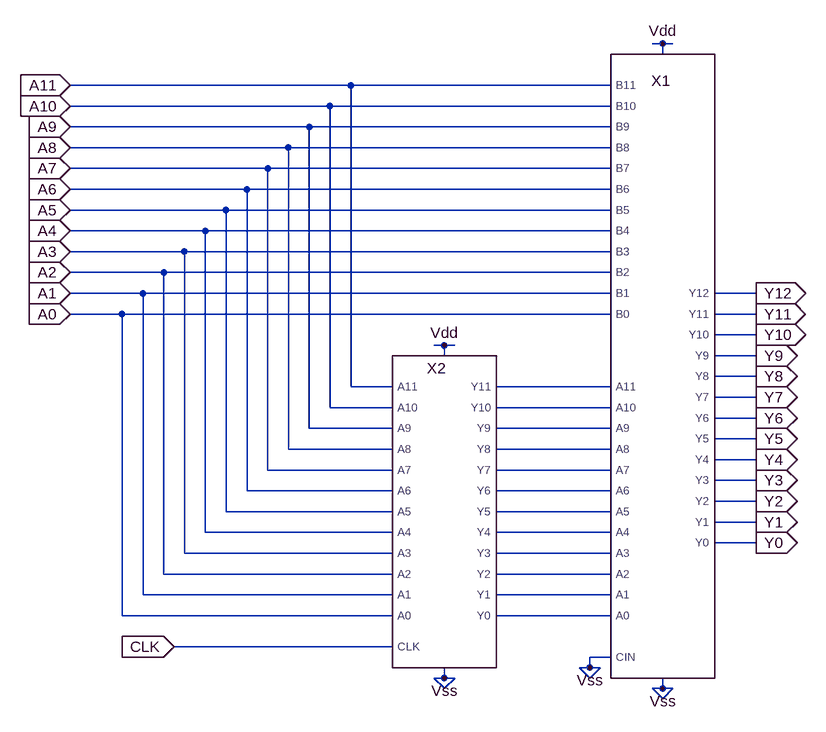
[diagram p0: schematic 12bitavg.asc]
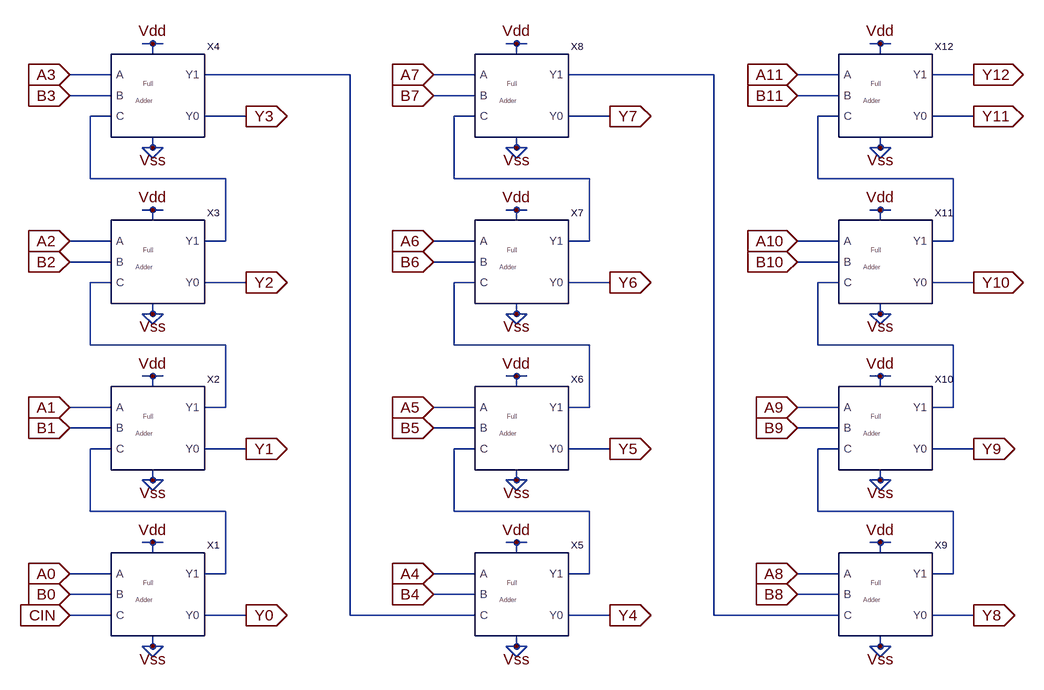
[diagram p1: sub-circuit 12bitadder.asc]
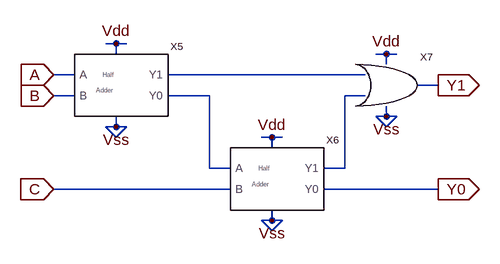
[diagram p2: sub-circuit fulladder.asc]
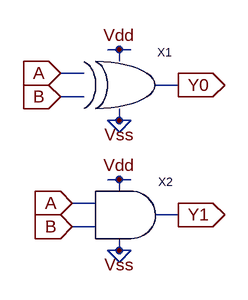
[diagram p3: sub-circuit halfadder.asc]
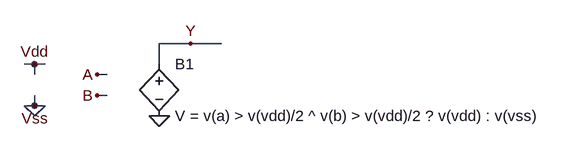
[diagram p4: sub-circuit xor.asc]
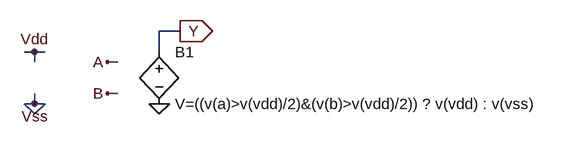
[diagram p5: sub-circuit and.asc]
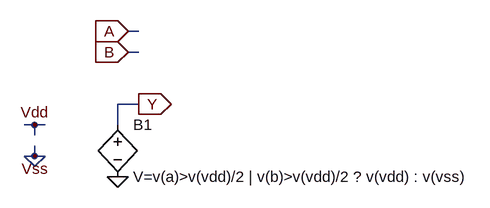
[diagram p6: sub-circuit or.asc]
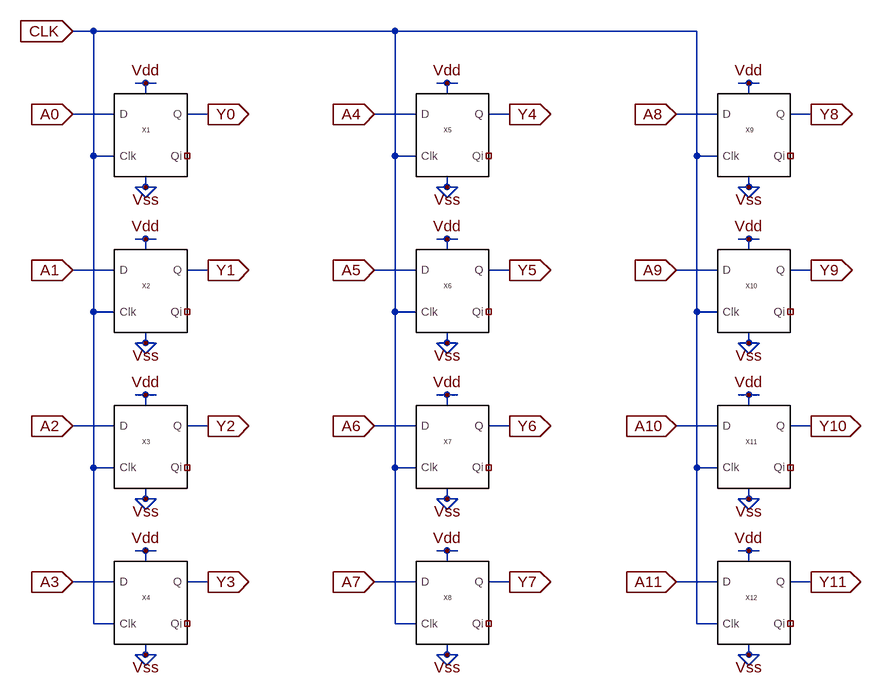
[diagram p7: sub-circuit 12bitreg.asc]
12bitavg.asc, the LTspice schematic file:
Version 4
SHEET 1 880 680
WIRE 96 -592 80 -592
WIRE 112 -592 96 -592
WIRE 96 -576 96 -592
WIRE -384 -528 -816 -528
WIRE 16 -528 -384 -528
WIRE -416 -496 -816 -496
WIRE 16 -496 -416 -496
WIRE -448 -464 -816 -464
WIRE 16 -464 -448 -464
WIRE -480 -432 -816 -432
WIRE 16 -432 -480 -432
WIRE -512 -400 -816 -400
WIRE 16 -400 -512 -400
WIRE -544 -368 -816 -368
WIRE 16 -368 -544 -368
WIRE -576 -336 -816 -336
WIRE 16 -336 -576 -336
WIRE -608 -304 -816 -304
WIRE 16 -304 -608 -304
WIRE -640 -272 -816 -272
WIRE 16 -272 -640 -272
WIRE -672 -240 -816 -240
WIRE 16 -240 -672 -240
WIRE -704 -208 -816 -208
WIRE 16 -208 -704 -208
WIRE 240 -208 176 -208
WIRE -736 -176 -816 -176
WIRE 16 -176 -736 -176
WIRE 240 -176 176 -176
WIRE 240 -144 176 -144
WIRE -240 -128 -256 -128
WIRE -224 -128 -240 -128
WIRE -240 -112 -240 -128
WIRE 240 -112 176 -112
WIRE 240 -80 176 -80
WIRE -384 -64 -384 -528
WIRE -320 -64 -384 -64
WIRE 16 -64 -160 -64
WIRE 240 -48 176 -48
WIRE -416 -32 -416 -496
WIRE -320 -32 -416 -32
WIRE 16 -32 -160 -32
WIRE 240 -16 176 -16
WIRE -448 0 -448 -464
WIRE -320 0 -448 0
WIRE 16 0 -160 0
WIRE 240 16 176 16
WIRE -480 32 -480 -432
WIRE -320 32 -480 32
WIRE 16 32 -160 32
WIRE 240 48 176 48
WIRE -512 64 -512 -400
WIRE -320 64 -512 64
WIRE 16 64 -160 64
WIRE 240 80 176 80
WIRE -544 96 -544 -368
WIRE -320 96 -544 96
WIRE 16 96 -160 96
WIRE 240 112 176 112
WIRE -576 128 -576 -336
WIRE -320 128 -576 128
WIRE 16 128 -160 128
WIRE 240 144 176 144
WIRE -608 160 -608 -304
WIRE -320 160 -608 160
WIRE 16 160 -160 160
WIRE 240 176 176 176
WIRE -640 192 -640 -272
WIRE -320 192 -640 192
WIRE 16 192 -160 192
WIRE -672 224 -672 -240
WIRE -320 224 -672 224
WIRE 16 224 -160 224
WIRE -704 256 -704 -208
WIRE -320 256 -704 256
WIRE 16 256 -160 256
WIRE -736 288 -736 -176
WIRE -320 288 -736 288
WIRE 16 288 -160 288
WIRE -320 336 -656 336
WIRE 16 352 -16 352
WIRE -16 368 -16 352
WIRE -16 368 -32 368
WIRE 0 368 -16 368
WIRE -240 384 -240 368
WIRE -240 384 -256 384
WIRE -224 384 -240 384
WIRE -16 384 -32 368
WIRE -16 384 0 368
WIRE -240 400 -256 384
WIRE -240 400 -224 384
WIRE 96 400 96 384
WIRE 96 400 80 400
WIRE 112 400 96 400
WIRE 96 416 80 400
WIRE 96 416 112 400
FLAG 96 -592 Vdd
FLAG 96 400 Vss
FLAG 240 176 Y0
IOPIN 240 176 Out
FLAG 240 144 Y1
IOPIN 240 144 Out
FLAG 240 112 Y2
IOPIN 240 112 Out
FLAG 240 80 Y3
IOPIN 240 80 Out
FLAG 240 48 Y4
IOPIN 240 48 Out
FLAG 240 16 Y5
IOPIN 240 16 Out
FLAG 240 -16 Y6
IOPIN 240 -16 Out
FLAG 240 -48 Y7
IOPIN 240 -48 Out
FLAG 240 -80 Y8
IOPIN 240 -80 Out
FLAG -16 368 Vss
FLAG -816 -176 A0
IOPIN -816 -176 In
FLAG -816 -208 A1
IOPIN -816 -208 In
FLAG -816 -240 A2
IOPIN -816 -240 In
FLAG -816 -272 A3
IOPIN -816 -272 In
FLAG -816 -304 A4
IOPIN -816 -304 In
FLAG -816 -336 A5
IOPIN -816 -336 In
FLAG -816 -368 A6
IOPIN -816 -368 In
FLAG -816 -400 A7
IOPIN -816 -400 In
FLAG -656 336 CLK
IOPIN -656 336 In
FLAG -240 384 Vss
FLAG -240 -128 Vdd
FLAG -816 -432 A8
IOPIN -816 -432 In
FLAG -816 -464 A9
IOPIN -816 -464 In
FLAG -816 -496 A10
IOPIN -816 -496 In
FLAG -816 -528 A11
IOPIN -816 -528 In
FLAG 240 -112 Y9
IOPIN 240 -112 Out
FLAG 240 -144 Y10
IOPIN 240 -144 Out
FLAG 240 -176 Y11
IOPIN 240 -176 Out
FLAG 240 -208 Y12
IOPIN 240 -208 Out
SYMBOL 12bitadder 16 384 R0
WINDOW 0 63 -919 Left 0
SYMATTR InstName X1
SYMBOL 12bitreg -320 368 R0
WINDOW 1 78 -178 VLeft 0
SYMATTR InstName X2

12bitadder.asc, the sub-circuit schematic file:
Version 4
SHEET 1 3036 1012
WIRE 1104 32 1088 32
WIRE 1120 32 1104 32
WIRE 1664 32 1648 32
WIRE 1680 32 1664 32
WIRE 2224 32 2208 32
WIRE 2240 32 2224 32
WIRE 1104 48 1104 32
WIRE 1664 48 1664 32
WIRE 2224 48 2224 32
WIRE 1040 80 976 80
WIRE 1408 80 1184 80
WIRE 1600 80 1536 80
WIRE 1968 80 1744 80
WIRE 2160 80 2096 80
WIRE 2368 80 2304 80
WIRE 1040 112 976 112
WIRE 1600 112 1536 112
WIRE 2160 112 2096 112
WIRE 1040 144 1008 144
WIRE 1248 144 1184 144
WIRE 1600 144 1568 144
WIRE 1808 144 1744 144
WIRE 2160 144 2128 144
WIRE 2368 144 2304 144
WIRE 1104 192 1104 176
WIRE 1104 192 1088 192
WIRE 1120 192 1104 192
WIRE 1664 192 1664 176
WIRE 1664 192 1648 192
WIRE 1680 192 1664 192
WIRE 2224 192 2224 176
WIRE 2224 192 2208 192
WIRE 2240 192 2224 192
WIRE 1104 208 1088 192
WIRE 1104 208 1120 192
WIRE 1664 208 1648 192
WIRE 1664 208 1680 192
WIRE 2224 208 2208 192
WIRE 2224 208 2240 192
WIRE 1008 240 1008 144
WIRE 1216 240 1008 240
WIRE 1568 240 1568 144
WIRE 1776 240 1568 240
WIRE 2128 240 2128 144
WIRE 2336 240 2128 240
WIRE 1104 288 1088 288
WIRE 1120 288 1104 288
WIRE 1664 288 1648 288
WIRE 1680 288 1664 288
WIRE 2224 288 2208 288
WIRE 2240 288 2224 288
WIRE 1104 304 1104 288
WIRE 1664 304 1664 288
WIRE 2224 304 2224 288
WIRE 1040 336 976 336
WIRE 1216 336 1216 240
WIRE 1216 336 1184 336
WIRE 1600 336 1536 336
WIRE 1776 336 1776 240
WIRE 1776 336 1744 336
WIRE 2160 336 2096 336
WIRE 2336 336 2336 240
WIRE 2336 336 2304 336
WIRE 1040 368 976 368
WIRE 1600 368 1536 368
WIRE 2160 368 2096 368
WIRE 1040 400 1008 400
WIRE 1248 400 1184 400
WIRE 1600 400 1568 400
WIRE 1808 400 1744 400
WIRE 2160 400 2128 400
WIRE 2368 400 2304 400
WIRE 1104 448 1104 432
WIRE 1104 448 1088 448
WIRE 1120 448 1104 448
WIRE 1664 448 1664 432
WIRE 1664 448 1648 448
WIRE 1680 448 1664 448
WIRE 2224 448 2224 432
WIRE 2224 448 2208 448
WIRE 2240 448 2224 448
WIRE 1104 464 1088 448
WIRE 1104 464 1120 448
WIRE 1664 464 1648 448
WIRE 1664 464 1680 448
WIRE 2224 464 2208 448
WIRE 2224 464 2240 448
WIRE 1008 496 1008 400
WIRE 1216 496 1008 496
WIRE 1568 496 1568 400
WIRE 1776 496 1568 496
WIRE 2128 496 2128 400
WIRE 2336 496 2128 496
WIRE 1104 544 1088 544
WIRE 1120 544 1104 544
WIRE 1664 544 1648 544
WIRE 1680 544 1664 544
WIRE 2224 544 2208 544
WIRE 2240 544 2224 544
WIRE 1104 560 1104 544
WIRE 1664 560 1664 544
WIRE 2224 560 2224 544
WIRE 1040 592 976 592
WIRE 1216 592 1216 496
WIRE 1216 592 1184 592
WIRE 1600 592 1536 592
WIRE 1776 592 1776 496
WIRE 1776 592 1744 592
WIRE 2160 592 2096 592
WIRE 2336 592 2336 496
WIRE 2336 592 2304 592
WIRE 1040 624 976 624
WIRE 1600 624 1536 624
WIRE 2160 624 2096 624
WIRE 1040 656 1008 656
WIRE 1248 656 1184 656
WIRE 1600 656 1568 656
WIRE 1808 656 1744 656
WIRE 2160 656 2128 656
WIRE 2368 656 2304 656
WIRE 1104 704 1104 688
WIRE 1104 704 1088 704
WIRE 1120 704 1104 704
WIRE 1664 704 1664 688
WIRE 1664 704 1648 704
WIRE 1680 704 1664 704
WIRE 2224 704 2224 688
WIRE 2224 704 2208 704
WIRE 2240 704 2224 704
WIRE 1104 720 1088 704
WIRE 1104 720 1120 704
WIRE 1664 720 1648 704
WIRE 1664 720 1680 704
WIRE 2224 720 2208 704
WIRE 2224 720 2240 704
WIRE 1008 752 1008 656
WIRE 1216 752 1008 752
WIRE 1568 752 1568 656
WIRE 1776 752 1568 752
WIRE 2128 752 2128 656
WIRE 2336 752 2128 752
WIRE 1104 800 1088 800
WIRE 1120 800 1104 800
WIRE 1664 800 1648 800
WIRE 1680 800 1664 800
WIRE 2224 800 2208 800
WIRE 2240 800 2224 800
WIRE 1104 816 1104 800
WIRE 1664 816 1664 800
WIRE 2224 816 2224 800
WIRE 1040 848 976 848
WIRE 1216 848 1216 752
WIRE 1216 848 1184 848
WIRE 1600 848 1536 848
WIRE 1776 848 1776 752
WIRE 1776 848 1744 848
WIRE 2160 848 2096 848
WIRE 2336 848 2336 752
WIRE 2336 848 2304 848
WIRE 1040 880 976 880
WIRE 1600 880 1536 880
WIRE 2160 880 2096 880
WIRE 1040 912 976 912
WIRE 1248 912 1184 912
WIRE 1408 912 1408 80
WIRE 1600 912 1408 912
WIRE 1808 912 1744 912
WIRE 1968 912 1968 80
WIRE 2160 912 1968 912
WIRE 2368 912 2304 912
WIRE 1104 960 1104 944
WIRE 1104 960 1088 960
WIRE 1120 960 1104 960
WIRE 1664 960 1664 944
WIRE 1664 960 1648 960
WIRE 1680 960 1664 960
WIRE 2224 960 2224 944
WIRE 2224 960 2208 960
WIRE 2240 960 2224 960
WIRE 1104 976 1088 960
WIRE 1104 976 1120 960
WIRE 1664 976 1648 960
WIRE 1664 976 1680 960
WIRE 2224 976 2208 960
WIRE 2224 976 2240 960
FLAG 976 848 A0
IOPIN 976 848 In
FLAG 976 880 B0
IOPIN 976 880 In
FLAG 1104 800 Vdd
FLAG 1104 960 Vss
FLAG 976 592 A1
IOPIN 976 592 In
FLAG 976 624 B1
IOPIN 976 624 In
FLAG 1104 544 Vdd
FLAG 1104 704 Vss
FLAG 976 336 A2
IOPIN 976 336 In
FLAG 976 368 B2
IOPIN 976 368 In
FLAG 1104 288 Vdd
FLAG 1104 448 Vss
FLAG 976 80 A3
IOPIN 976 80 In
FLAG 976 112 B3
IOPIN 976 112 In
FLAG 1104 32 Vdd
FLAG 1104 192 Vss
FLAG 976 912 CIN
IOPIN 976 912 In
FLAG 1248 912 Y0
IOPIN 1248 912 Out
FLAG 1248 656 Y1
IOPIN 1248 656 Out
FLAG 1248 400 Y2
IOPIN 1248 400 Out
FLAG 1248 144 Y3
IOPIN 1248 144 Out
FLAG 1536 848 A4
IOPIN 1536 848 In
FLAG 1536 880 B4
IOPIN 1536 880 In
FLAG 1664 800 Vdd
FLAG 1664 960 Vss
FLAG 1536 592 A5
IOPIN 1536 592 In
FLAG 1536 624 B5
IOPIN 1536 624 In
FLAG 1664 544 Vdd
FLAG 1664 704 Vss
FLAG 1536 336 A6
IOPIN 1536 336 In
FLAG 1536 368 B6
IOPIN 1536 368 In
FLAG 1664 288 Vdd
FLAG 1664 448 Vss
FLAG 1536 80 A7
IOPIN 1536 80 In
FLAG 1536 112 B7
IOPIN 1536 112 In
FLAG 1664 32 Vdd
FLAG 1664 192 Vss
FLAG 1808 912 Y4
IOPIN 1808 912 Out
FLAG 1808 656 Y5
IOPIN 1808 656 Out
FLAG 1808 400 Y6
IOPIN 1808 400 Out
FLAG 1808 144 Y7
IOPIN 1808 144 Out
FLAG 2096 848 A8
IOPIN 2096 848 In
FLAG 2096 880 B8
IOPIN 2096 880 In
FLAG 2224 800 Vdd
FLAG 2224 960 Vss
FLAG 2096 592 A9
IOPIN 2096 592 In
FLAG 2096 624 B9
IOPIN 2096 624 In
FLAG 2224 544 Vdd
FLAG 2224 704 Vss
FLAG 2096 336 A10
IOPIN 2096 336 In
FLAG 2096 368 B10
IOPIN 2096 368 In
FLAG 2224 288 Vdd
FLAG 2224 448 Vss
FLAG 2096 80 A11
IOPIN 2096 80 In
FLAG 2096 112 B11
IOPIN 2096 112 In
FLAG 2224 32 Vdd
FLAG 2224 192 Vss
FLAG 2368 912 Y8
IOPIN 2368 912 Out
FLAG 2368 656 Y9
IOPIN 2368 656 Out
FLAG 2368 400 Y10
IOPIN 2368 400 Out
FLAG 2368 144 Y11
IOPIN 2368 144 Out
FLAG 2368 80 Y12
IOPIN 2368 80 Out
SYMBOL fulladder 1040 944 R0
SYMATTR InstName X1
SYMBOL fulladder 1040 688 R0
SYMATTR InstName X2
SYMBOL fulladder 1040 432 R0
SYMATTR InstName X3
SYMBOL fulladder 1040 176 R0
SYMATTR InstName X4
SYMBOL fulladder 1600 944 R0
SYMATTR InstName X5
SYMBOL fulladder 1600 688 R0
SYMATTR InstName X6
SYMBOL fulladder 1600 432 R0
SYMATTR InstName X7
SYMBOL fulladder 1600 176 R0
SYMATTR InstName X8
SYMBOL fulladder 2160 944 R0
SYMATTR InstName X9
SYMBOL fulladder 2160 688 R0
SYMATTR InstName X10
SYMBOL fulladder 2160 432 R0
SYMATTR InstName X11
SYMBOL fulladder 2160 176 R0
SYMATTR InstName X12

fulladder.asc, the sub-circuit schematic file:
Version 4
SHEET 1 1124 956
WIRE 112 64 96 64
WIRE 128 64 112 64
WIRE 112 80 112 64
WIRE 528 80 512 80
WIRE 544 80 528 80
WIRE 528 96 528 80
WIRE 48 112 16 112
WIRE 496 112 192 112
WIRE 608 128 576 128
WIRE 48 144 16 144
WIRE 256 144 192 144
WIRE 496 144 464 144
WIRE 528 176 528 160
WIRE 528 176 512 176
WIRE 544 176 528 176
WIRE 112 192 112 176
WIRE 112 192 96 192
WIRE 128 192 112 192
WIRE 528 192 512 176
WIRE 528 192 544 176
WIRE 112 208 96 192
WIRE 112 208 128 192
WIRE 352 208 336 208
WIRE 368 208 352 208
WIRE 352 224 352 208
WIRE 256 256 256 144
WIRE 288 256 256 256
WIRE 464 256 464 144
WIRE 464 256 432 256
WIRE 288 288 16 288
WIRE 608 288 432 288
WIRE 352 336 352 320
WIRE 352 336 336 336
WIRE 368 336 352 336
WIRE 352 352 336 336
WIRE 352 352 368 336
FLAG 112 64 Vdd
FLAG 112 192 Vss
FLAG 352 208 Vdd
FLAG 352 336 Vss
FLAG 608 288 Y0
IOPIN 608 288 Out
FLAG 16 112 A
IOPIN 16 112 In
FLAG 16 144 B
IOPIN 16 144 In
FLAG 16 288 C
IOPIN 16 288 In
FLAG 528 80 Vdd
FLAG 528 176 Vss
FLAG 608 128 Y1
IOPIN 608 128 Out
SYMBOL HalfAdder 48 176 R0
SYMATTR InstName X5
SYMBOL HalfAdder 288 320 R0
SYMATTR InstName X6
SYMBOL or 496 128 R0
SYMATTR InstName X7

halfadder.asc, the sub-circuit schematic file:
Version 4
SHEET 1 880 680
WIRE 96 240 80 240
WIRE 112 240 96 240
WIRE 96 256 96 240
WIRE 48 272 16 272
WIRE 176 288 144 288
WIRE 48 304 16 304
WIRE 96 336 96 320
WIRE 96 336 80 336
WIRE 112 336 96 336
WIRE 96 352 80 336
WIRE 96 352 112 336
WIRE 96 416 80 416
WIRE 112 416 96 416
WIRE 96 432 96 416
WIRE 64 448 32 448
WIRE 176 464 144 464
WIRE 64 480 32 480
WIRE 96 512 96 496
WIRE 96 512 80 512
WIRE 112 512 96 512
WIRE 96 528 80 512
WIRE 96 528 112 512
FLAG 16 272 A
IOPIN 16 272 In
FLAG 16 304 B
IOPIN 16 304 In
FLAG 176 288 Y0
IOPIN 176 288 Out
FLAG 96 240 Vdd
FLAG 96 336 Vss
FLAG 96 416 Vdd
FLAG 96 512 Vss
FLAG 32 448 A
IOPIN 32 448 In
FLAG 32 480 B
IOPIN 32 480 In
FLAG 176 464 Y1
IOPIN 176 464 Out
SYMBOL xor 48 288 R0
SYMATTR InstName X1
SYMBOL and 64 464 R0
SYMATTR InstName X2

xor.asc, the sub-circuit schematic file:
Version 4
SHEET 1 1264 952
WIRE 592 448 544 448
WIRE 640 448 592 448
WIRE 352 480 336 480
WIRE 368 480 352 480
WIRE 544 480 544 448
WIRE 352 496 352 480
WIRE 464 496 448 496
WIRE 464 528 448 528
WIRE 352 544 352 528
WIRE 352 544 336 544
WIRE 368 544 352 544
WIRE 352 560 336 544
WIRE 352 560 368 544
FLAG 448 496 A
FLAG 448 528 B
FLAG 352 480 Vdd
FLAG 352 544 Vss
FLAG 544 560 0
FLAG 592 448 Y
SYMBOL bv 544 464 R0
SYMATTR InstName B1
SYMATTR Value V = v(a) > v(vdd)/2 ^ v(b) > v(vdd)/2 ? v(vdd) : v(vss)

and.asc, the sub-circuit schematic file:
Version 4
SHEET 1 1192 680
WIRE 560 80 528 80
WIRE 336 112 320 112
WIRE 352 112 336 112
WIRE 528 112 528 80
WIRE 336 128 336 112
WIRE 464 128 448 128
WIRE 464 176 448 176
WIRE 336 192 336 176
WIRE 336 192 320 192
WIRE 352 192 336 192
WIRE 336 208 320 192
WIRE 336 208 352 192
FLAG 448 128 A
FLAG 448 176 B
FLAG 336 112 Vdd
FLAG 560 80 Y
IOPIN 560 80 Out
FLAG 336 192 Vss
FLAG 528 192 0
SYMBOL bv 528 96 R0
SYMATTR InstName B1
SYMATTR Value V=((v(a)>v(vdd)/2)&(v(b)>v(vdd)/2)) ? v(vdd) : v(vss)

or.asc, the sub-circuit schematic file:
Version 4
SHEET 1 1284 680
WIRE 656 0 640 0
WIRE 656 32 640 32
WIRE 656 112 624 112
WIRE 496 144 480 144
WIRE 512 144 496 144
WIRE 624 144 624 112
WIRE 496 160 496 144
WIRE 496 192 496 176
WIRE 496 192 480 192
WIRE 512 192 496 192
WIRE 496 208 480 192
WIRE 496 208 512 192
FLAG 656 112 Y
IOPIN 656 112 Out
FLAG 624 224 0
FLAG 640 0 A
IOPIN 640 0 In
FLAG 640 32 B
IOPIN 640 32 In
FLAG 496 144 Vdd
FLAG 496 192 Vss
SYMBOL bv 624 128 R0
SYMATTR InstName B1
SYMATTR Value V=v(a)>v(vdd)/2 | v(b)>v(vdd)/2 ? v(vdd) : v(vss)

12bitreg.asc, the sub-circuit schematic file:
Version 4
SHEET 1 1484 1012
WIRE -192 -224 -224 -224
WIRE 272 -224 -192 -224
WIRE 736 -224 272 -224
WIRE -112 -144 -128 -144
WIRE -96 -144 -112 -144
WIRE 352 -144 336 -144
WIRE 368 -144 352 -144
WIRE 816 -144 800 -144
WIRE 832 -144 816 -144
WIRE -112 -128 -112 -144
WIRE 352 -128 352 -144
WIRE 816 -128 816 -144
WIRE -160 -96 -224 -96
WIRE -16 -96 -48 -96
WIRE 304 -96 240 -96
WIRE 448 -96 416 -96
WIRE 768 -96 704 -96
WIRE 912 -96 880 -96
WIRE -192 -32 -192 -224
WIRE -160 -32 -192 -32
WIRE 272 -32 272 -224
WIRE 304 -32 272 -32
WIRE 736 -32 736 -224
WIRE 768 -32 736 -32
WIRE -112 16 -112 0
WIRE -112 16 -128 16
WIRE -96 16 -112 16
WIRE 352 16 352 0
WIRE 352 16 336 16
WIRE 368 16 352 16
WIRE 816 16 816 0
WIRE 816 16 800 16
WIRE 832 16 816 16
WIRE -112 32 -128 16
WIRE -112 32 -96 16
WIRE 352 32 336 16
WIRE 352 32 368 16
WIRE 816 32 800 16
WIRE 816 32 832 16
WIRE -112 96 -128 96
WIRE -96 96 -112 96
WIRE 352 96 336 96
WIRE 368 96 352 96
WIRE 816 96 800 96
WIRE 832 96 816 96
WIRE -112 112 -112 96
WIRE 352 112 352 96
WIRE 816 112 816 96
WIRE -160 144 -224 144
WIRE -16 144 -48 144
WIRE 304 144 240 144
WIRE 448 144 416 144
WIRE 768 144 704 144
WIRE 912 144 880 144
WIRE -192 208 -192 -32
WIRE -160 208 -192 208
WIRE 272 208 272 -32
WIRE 304 208 272 208
WIRE 736 208 736 -32
WIRE 768 208 736 208
WIRE -112 256 -112 240
WIRE -112 256 -128 256
WIRE -96 256 -112 256
WIRE 352 256 352 240
WIRE 352 256 336 256
WIRE 368 256 352 256
WIRE 816 256 816 240
WIRE 816 256 800 256
WIRE 832 256 816 256
WIRE -112 272 -128 256
WIRE -112 272 -96 256
WIRE 352 272 336 256
WIRE 352 272 368 256
WIRE 816 272 800 256
WIRE 816 272 832 256
WIRE -112 336 -128 336
WIRE -96 336 -112 336
WIRE 352 336 336 336
WIRE 368 336 352 336
WIRE 816 336 800 336
WIRE 832 336 816 336
WIRE -112 352 -112 336
WIRE 352 352 352 336
WIRE 816 352 816 336
WIRE -160 384 -224 384
WIRE -16 384 -48 384
WIRE 304 384 240 384
WIRE 448 384 416 384
WIRE 768 384 704 384
WIRE 912 384 880 384
WIRE -192 448 -192 208
WIRE -160 448 -192 448
WIRE 272 448 272 208
WIRE 304 448 272 448
WIRE 736 448 736 208
WIRE 768 448 736 448
WIRE -112 496 -112 480
WIRE -112 496 -128 496
WIRE -96 496 -112 496
WIRE 352 496 352 480
WIRE 352 496 336 496
WIRE 368 496 352 496
WIRE 816 496 816 480
WIRE 816 496 800 496
WIRE 832 496 816 496
WIRE -112 512 -128 496
WIRE -112 512 -96 496
WIRE 352 512 336 496
WIRE 352 512 368 496
WIRE 816 512 800 496
WIRE 816 512 832 496
WIRE -112 576 -128 576
WIRE -96 576 -112 576
WIRE 352 576 336 576
WIRE 368 576 352 576
WIRE 816 576 800 576
WIRE 832 576 816 576
WIRE -112 592 -112 576
WIRE 352 592 352 576
WIRE 816 592 816 576
WIRE -160 624 -224 624
WIRE -16 624 -48 624
WIRE 304 624 240 624
WIRE 448 624 416 624
WIRE 768 624 704 624
WIRE 912 624 880 624
WIRE -192 688 -192 448
WIRE -160 688 -192 688
WIRE 272 688 272 448
WIRE 304 688 272 688
WIRE 736 688 736 448
WIRE 768 688 736 688
WIRE -112 736 -112 720
WIRE -112 736 -128 736
WIRE -96 736 -112 736
WIRE 352 736 352 720
WIRE 352 736 336 736
WIRE 368 736 352 736
WIRE 816 736 816 720
WIRE 816 736 800 736
WIRE 832 736 816 736
WIRE -112 752 -128 736
WIRE -112 752 -96 736
WIRE 352 752 336 736
WIRE 352 752 368 736
WIRE 816 752 800 736
WIRE 816 752 832 736
FLAG -112 -144 Vdd
FLAG -112 16 Vss
FLAG -224 -96 A0
IOPIN -224 -96 In
FLAG -16 -96 Y0
IOPIN -16 -96 Out
FLAG -112 96 Vdd
FLAG -112 256 Vss
FLAG -224 144 A1
IOPIN -224 144 In
FLAG -16 144 Y1
IOPIN -16 144 Out
FLAG -112 336 Vdd
FLAG -112 496 Vss
FLAG -224 384 A2
IOPIN -224 384 In
FLAG -16 384 Y2
IOPIN -16 384 Out
FLAG -112 576 Vdd
FLAG -112 736 Vss
FLAG -224 624 A3
IOPIN -224 624 In
FLAG -16 624 Y3
IOPIN -16 624 Out
FLAG -224 -224 CLK
IOPIN -224 -224 In
FLAG 352 -144 Vdd
FLAG 352 16 Vss
FLAG 240 -96 A4
IOPIN 240 -96 In
FLAG 448 -96 Y4
IOPIN 448 -96 Out
FLAG 352 96 Vdd
FLAG 352 256 Vss
FLAG 240 144 A5
IOPIN 240 144 In
FLAG 448 144 Y5
IOPIN 448 144 Out
FLAG 352 336 Vdd
FLAG 352 496 Vss
FLAG 240 384 A6
IOPIN 240 384 In
FLAG 448 384 Y6
IOPIN 448 384 Out
FLAG 352 576 Vdd
FLAG 352 736 Vss
FLAG 240 624 A7
IOPIN 240 624 In
FLAG 448 624 Y7
IOPIN 448 624 Out
FLAG 816 -144 Vdd
FLAG 816 16 Vss
FLAG 704 -96 A8
IOPIN 704 -96 In
FLAG 912 -96 Y8
IOPIN 912 -96 Out
FLAG 816 96 Vdd
FLAG 816 256 Vss
FLAG 704 144 A9
IOPIN 704 144 In
FLAG 912 144 Y9
IOPIN 912 144 Out
FLAG 816 336 Vdd
FLAG 816 496 Vss
FLAG 704 384 A10
IOPIN 704 384 In
FLAG 912 384 Y10
IOPIN 912 384 Out
FLAG 816 576 Vdd
FLAG 816 736 Vss
FLAG 704 624 A11
IOPIN 704 624 In
FLAG 912 624 Y11
IOPIN 912 624 Out
SYMBOL dff -160 0 R0
SYMATTR InstName X1
SYMBOL dff -160 240 R0
SYMATTR InstName X2
SYMBOL dff -160 480 R0
SYMATTR InstName X3
SYMBOL dff -160 720 R0
SYMATTR InstName X4
SYMBOL dff 304 0 R0
SYMATTR InstName X5
SYMBOL dff 304 240 R0
SYMATTR InstName X6
SYMBOL dff 304 480 R0
SYMATTR InstName X7
SYMBOL dff 304 720 R0
SYMATTR InstName X8
SYMBOL dff 768 0 R0
SYMATTR InstName X9
SYMBOL dff 768 240 R0
SYMATTR InstName X10
SYMBOL dff 768 480 R0
SYMATTR InstName X11
SYMBOL dff 768 720 R0
SYMATTR InstName X12

dff.asc, the sub-circuit schematic file:
Version 4
SHEET 1 880 680
WIRE 64 32 48 32
WIRE 64 64 48 64
WIRE 128 128 96 128
WIRE 320 128 288 128
WIRE 128 176 96 176
WIRE 320 176 304 176
FLAG 96 128 D
IOPIN 96 128 In
FLAG 96 176 CLK
IOPIN 96 176 In
FLAG 320 128 Q
IOPIN 320 128 Out
FLAG 320 176 Qi
IOPIN 320 176 Out
FLAG 48 32 Vdd
FLAG 48 64 Vss
SYMBOL Digital\\dflop 208 80 R0
SYMATTR InstName A1
SYMATTR SpiceLine vhigh=5 tau=1n

The netlist it stands for:
* 12bitavg.asc
XX1 Vdd Vss Vss N012 N011 N010 N009 N008 N007 N006 N005 N004 N003 N002 N001 A0 A1 A2 A3 A4 A5 A6 A7 A8 A9 A10 A11 Y0 Y1 Y2 Y3 Y4 Y5 Y6 Y7 Y8 Y9 Y10 Y11 Y12 12bitadder
XX2 Vdd Vss CLK A0 A1 A2 A3 A4 A5 A6 A7 A8 A9 A10 A11 N012 N011 N010 N009 N008 N007 N006 N005 N004 N003 N002 N001 12bitreg

* block symbol definitions
.subckt 12bitadder Vdd Vss CIN A0 A1 A2 A3 A4 A5 A6 A7 A8 A9 A10 A11 B0 B1 B2 B3 B4 B5 B6 B7 B8 B9 B10 B11 Y0 Y1 Y2 Y3 Y4 Y5 Y6 Y7 Y8 Y9 Y10 Y11 Y12
XX1 A0 B0 Y0 N009 Vdd Vss CIN fulladder
XX2 A1 B1 Y1 N006 Vdd Vss N009 fulladder
XX3 A2 B2 Y2 N003 Vdd Vss N006 fulladder
XX4 A3 B3 Y3 N001 Vdd Vss N003 fulladder
XX5 A4 B4 Y4 N010 Vdd Vss N001 fulladder
XX6 A5 B5 Y5 N007 Vdd Vss N010 fulladder
XX7 A6 B6 Y6 N004 Vdd Vss N007 fulladder
XX8 A7 B7 Y7 N002 Vdd Vss N004 fulladder
XX9 A8 B8 Y8 N011 Vdd Vss N002 fulladder
XX10 A9 B9 Y9 N008 Vdd Vss N011 fulladder
XX11 A10 B10 Y10 N005 Vdd Vss N008 fulladder
XX12 A11 B11 Y11 Y12 Vdd Vss N005 fulladder
.ends 12bitadder

.subckt fulladder A B Y0 Y1 Vdd Vss C
XX5 A B N002 N001 Vdd Vss halfadder
XX6 N002 C Y0 N003 Vdd Vss halfadder
XX7 N001 N003 Y1 Vdd Vss or
.ends fulladder

.subckt halfadder A B Y0 Y1 Vdd Vss
XX1 A B Y0 Vdd Vss xor
XX2 A B Y1 Vdd Vss and
.ends halfadder

.subckt xor A B Y Vdd Vss
B1 Y 0 V = v(a) > v(vdd)/2 ^ v(b) > v(vdd)/2 ? v(vdd) : v(vss)
.ends xor

.subckt and A B Y Vdd Vss
B1 Y 0 V=((v(a)>v(vdd)/2)&(v(b)>v(vdd)/2)) ? v(vdd) : v(vss)
.ends and

.subckt or A B Y Vdd Vss
B1 Y 0 V=v(a)>v(vdd)/2 | v(b)>v(vdd)/2 ? v(vdd) : v(vss)
.ends or

.subckt 12bitreg Vdd Vss CLK A0 A1 A2 A3 A4 A5 A6 A7 A8 A9 A10 A11 Y0 Y1 Y2 Y3 Y4 Y5 Y6 Y7 Y8 Y9 Y10 Y11
XX1 A0 CLK Y0 NC_01 Vdd Vss dff
XX2 A1 CLK Y1 NC_02 Vdd Vss dff
XX3 A2 CLK Y2 NC_03 Vdd Vss dff
XX4 A3 CLK Y3 NC_04 Vdd Vss dff
XX5 A4 CLK Y4 NC_05 Vdd Vss dff
XX6 A5 CLK Y5 NC_06 Vdd Vss dff
XX7 A6 CLK Y6 NC_07 Vdd Vss dff
XX8 A7 CLK Y7 NC_08 Vdd Vss dff
XX9 A8 CLK Y8 NC_09 Vdd Vss dff
XX10 A9 CLK Y9 NC_10 Vdd Vss dff
XX11 A10 CLK Y10 NC_11 Vdd Vss dff
XX12 A11 CLK Y11 NC_12 Vdd Vss dff
.ends 12bitreg

.subckt dff D Clk Q Qi VDD Vss
A1 D 0 CLK 0 0 Qi Q 0 DFLOP vhigh=5 tau=1n
.ends dff

.backanno
.end